# Altium project Quadcop_onboard_revised.PrjPcb
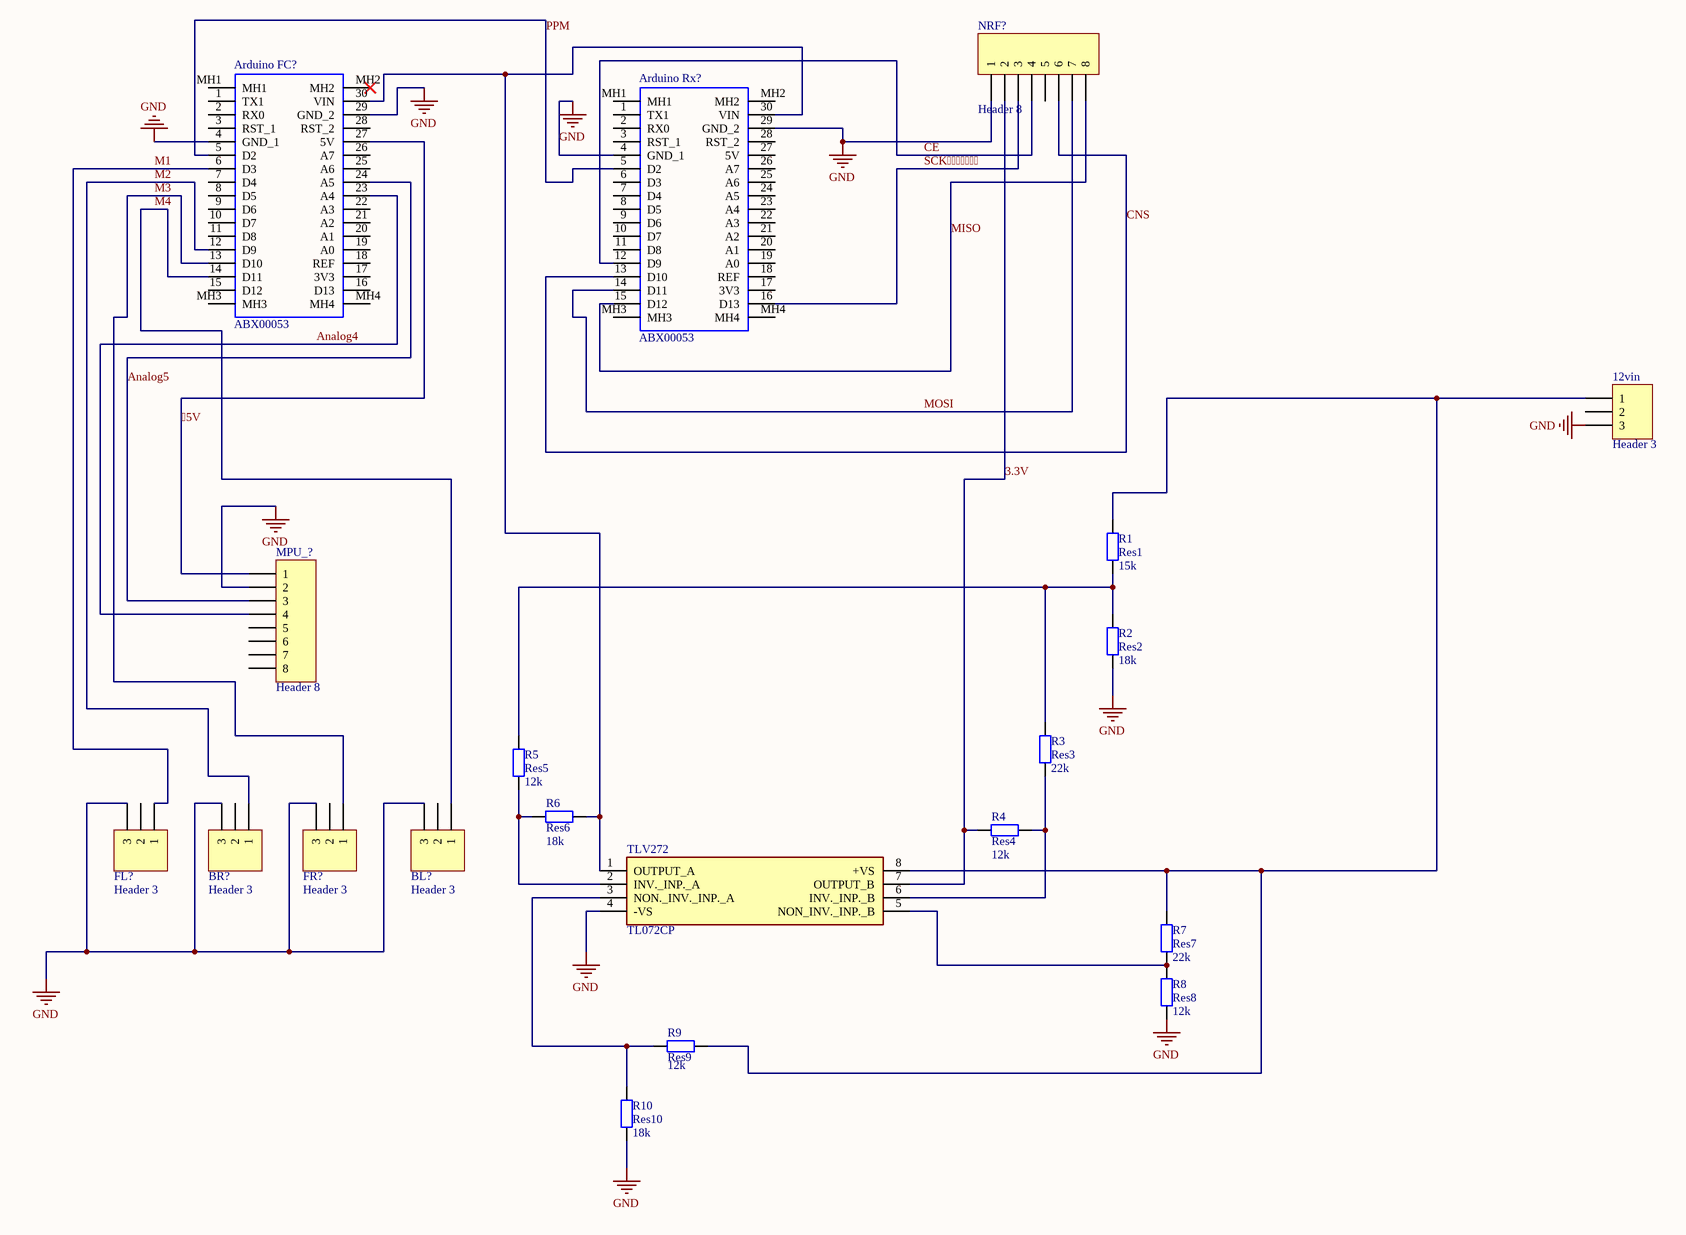
[diagram p0: Sheet1.SchDoc]
1 sheet, 20 parts. Net scope: global (net labels, ports and power ports of the same name join across sheets).
Board file: Sheet1.PcbDoc

## Sheet Sheet1.SchDoc
size C; SheetNumber: 1; SheetTotal: 1

### Parts
12vin  Header 3  [HDR1X3]
Arduino_FC  ABX00053  [ABX00053]
Arduino_Rx  ABX00053  [ABX00053]
BL  Header 3  [HDR1X3]
BR  Header 3  [HDR1X3]
FL  Header 3  [HDR1X3]
FR  Header 3  [HDR1X3]
MPU  Header 8  [HDR1X8]
NRF24  Header 8  [HDR1X8]
R1  Res1  value 15k  [AXIAL-0.4]
R2  Res2  value 18k  [AXIAL-0.4]
R3  Res3  value 22k  [AXIAL-0.4]
R4  Res4  value 12k  [AXIAL-0.4]
R5  Res5  value 12k  [AXIAL-0.4]
R6  Res6  value 18k  [AXIAL-0.4]
R7  Res7  value 22k  [AXIAL-0.4]
R8  Res8  value 12k  [AXIAL-0.4]
R9  Res9  value 12k  [AXIAL-0.4]
R10  Res10  value 18k  [AXIAL-0.4]
TLV272  TL072CP  [DIP760W50P254L976H406Q8N]

### Nets
GND: 12vin.3 Arduino_FC.4(GND_1) Arduino_FC.29(GND_2) Arduino_Rx.4(GND_1) Arduino_Rx.29(GND_2) BL.3 BR.3 FL.3 FR.3 MPU.2 NRF24.1 R2.2 R8.2 R10.2 TLV272.4(-VS)
3.3V: NRF24.2 R4.2 TLV272.7(OUTPUT_B)
5V: Arduino_FC.27(5V) MPU.1
Analog4: Arduino_FC.23(A4) MPU.4
Analog5: Arduino_FC.24(A5) MPU.3
CE: Arduino_Rx.12(D9) NRF24.4
CNS: Arduino_Rx.13(D10) NRF24.6
M1: Arduino_FC.6(D3) FL.1
M2: Arduino_FC.12(D9) BR.1
M3: Arduino_FC.13(D10) FR.1
M4: Arduino_FC.14(D11) BL.1
MISO: Arduino_Rx.15(D12) NRF24.8
MOSI: Arduino_Rx.14(D11) NRF24.7
PPM: Arduino_FC.5(D2) Arduino_Rx.5(D2)
SCK: Arduino_Rx.16(D13) NRF24.3
Net12vin_1: 12vin.1 R1.1 R7.1 R9.1 TLV272.8(+VS)
NetArduino_FC_30: Arduino_FC.30(VIN) Arduino_Rx.30(VIN) R6.1 TLV272.1(OUTPUT_A)
NetR1_2: R1.2 R2.1 R3.1 R5.1
NetR3_2: R3.2 R4.1 TLV272.6(INV._INP._B)
NetR5_2: R5.2 R6.2 TLV272.2(INV._INP._A)
NetR7_2: R7.2 R8.1 TLV272.5(NON_INV._INP._B)
NetR9_2: R9.2 R10.1 TLV272.3(NON._INV._INP._A)

Not connected (* = marked no-connect by the designer): 12vin 2; Arduino_FC 1(TX1) 2(RX0) 3(RST_1) 7(D4) 8(D5) 9(D6) 10(D7) 11(D8) 15(D12) 16(D13) 17(3V3) 18(REF) 19(A0) 20(A1) 21(A2) 22(A3) 25(A6) 26(A7) 28(RST_2) MH1 MH2* MH3 MH4; Arduino_Rx 1(TX1) 2(RX0) 3(RST_1) 6(D3) 7(D4) 8(D5) 9(D6) 10(D7) 11(D8) 17(3V3) 18(REF) 19(A0) 20(A1) 21(A2) 22(A3) 23(A4) 24(A5) 25(A6) 26(A7) 27(5V) 28(RST_2) MH1 MH2 MH3 MH4; BL 2; BR 2; FL 2; FR 2; MPU 5 6 7 8; NRF24 5

### Library data of the parts
12vin BL BR FL FR = Header 3: Header, 3-Pin; LatestRevisionDate: 17-Jul-2002; LatestRevisionNote: Re-released for DXP Platform.; Publisher: Altium Limited
Arduino_FC Arduino_Rx = ABX00053: Development Boards & Kits - AVR Arduino Nano RP2040 Connect with header; Geometry.Height: 3.25mm; Manufacturer_Name: Arduino; Manufacturer_Part_Number: ABX00053; Mouser Part Number: 782-ABX00053; Mouser Price/Stock: https://www.mouser.co.uk/ProductDetail/Arduino/ABX00053?qs=iLbezkQI%252Bsj092HEuR%252Bsvg%3D%3D; Arrow Part Number: ABX00053; Arrow Price/Stock: https://www.arrow.com/en/products/abx00053/arduino-corporation?region=nac; Mouser Testing Part Number: *; Mouser Testing Price/Stock: *; Datasheet Link: https://content.arduino.cc/assets/ABX00053-datasheet.pdf
MPU NRF24 = Header 8: Header, 8-Pin; LatestRevisionDate: 17-Jul-2002; LatestRevisionNote: Re-released for DXP Platform.; Publisher: Altium Limited
R1-R10 = Res2: Resistor; Published: 8-Jun-2000; LatestRevisionDate: 17-Jul-2002; LatestRevisionNote: Re-released for DXP Platform.; PackageReference: AXIAL-0.4; Publisher: Altium Limited; PackageDescription: Axial Device, Thru-Hole; 2 Leads; 0.4 in Pin Spacing
TLV272 = TL072CP: Operational Amplifier, 2 Func, 13000uV Offset-Max, PDIP8; Manufacturer_Name: STMicroelectronics; Geometry.Height: 4.06mm; Manufacturer_Part_Number: TL072CP; Mouser Part Number: *; Mouser Price/Stock: *; Arrow Part Number: *; Arrow Price/Stock: *; Datasheet Link: https://datasheet.datasheetarchive.com/originals/distributors/Datasheets-112/DSAP0044997.pdf